# Altium project EIS_CO2_V1_1.PrjPcb
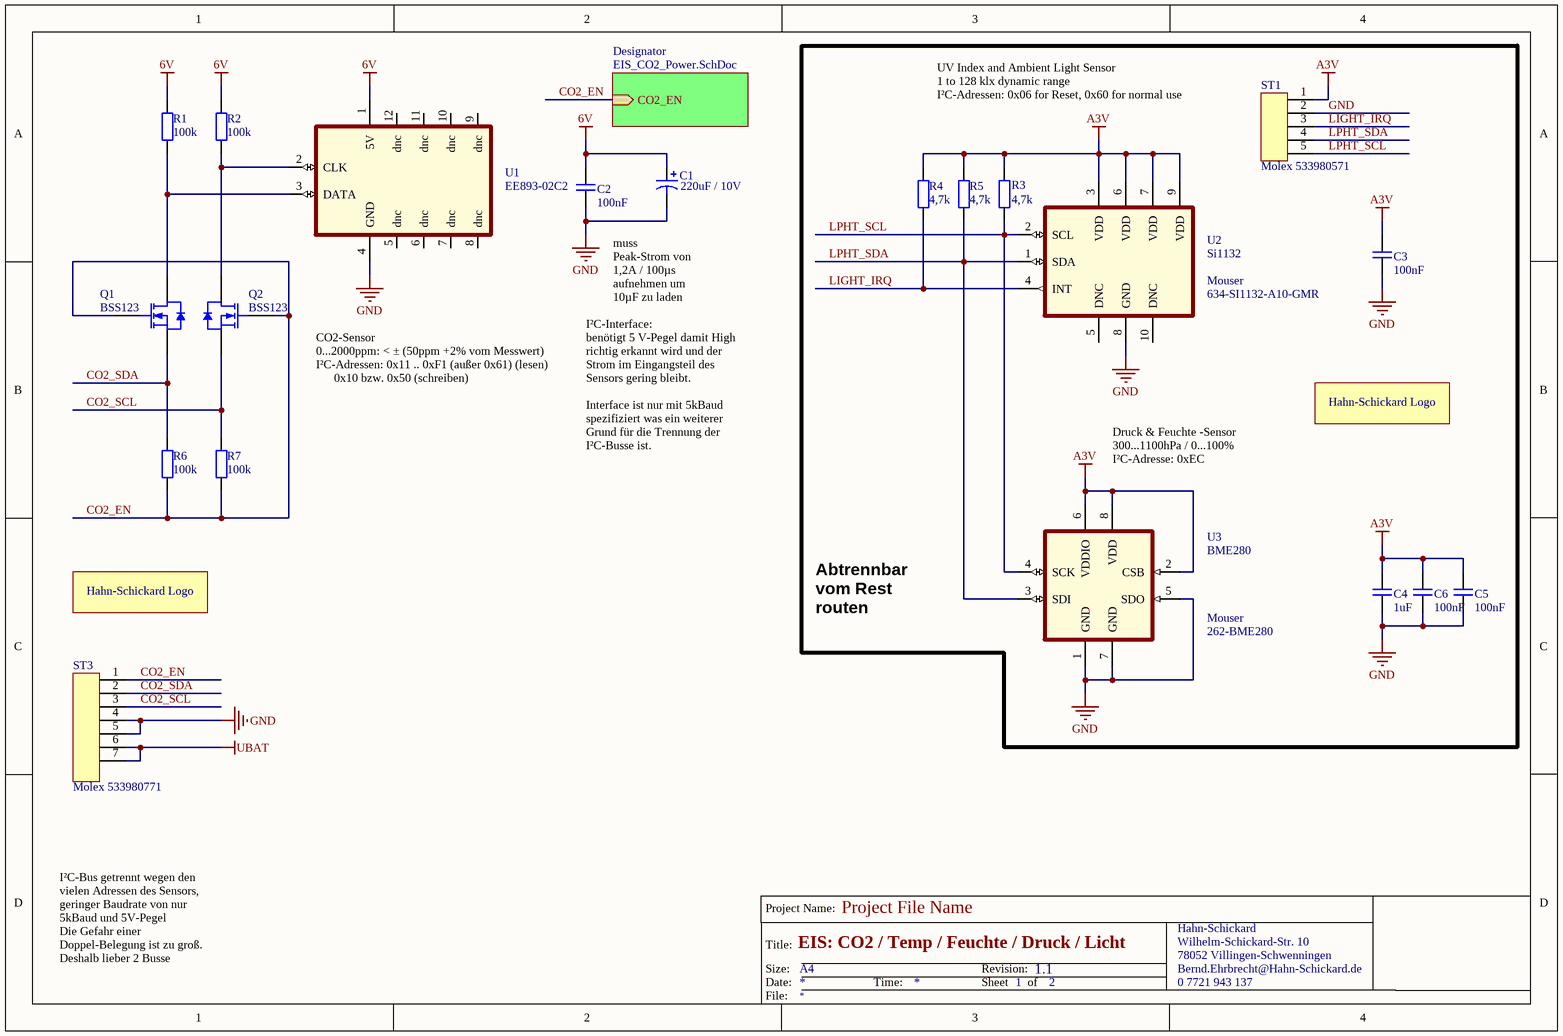
[diagram p0: EIS_Sensoren_V1_1.SchDoc]
2 sheets, 49 parts. Net scope: hierarchical (ports join the sheet entries above them; power ports are global).
Board file: EIS_Sensoren_V1_1.PcbDoc
Sheets:
  EIS_Sensoren_V1_1.SchDoc
    Designator = EIS_CO2_Power.SchDoc

## Sheet EIS_Sensoren_V1_1.SchDoc: EIS: CO2 / Temp / Feuchte / Druck / Licht
size A4; Organization: Hahn-Schickard; Address1: Wilhelm-Schickard-Str. 10; Address2: 78052 Villingen-Schwenningen; Address3: Bernd.Ehrbrecht@Hahn-Schickard.de; DocumentNumber: 1; Revision: 1.1; SheetNumber: 1; SheetTotal: 2; PhoneNumber: 0 7721 943 137; E-Mail: Bernd.Ehrbrecht@Hahn-Schickard.de; ProjectName: Project File Name

### Parts
C1  220uF / 10V  [D]
C2  100nF  [CAPC1608N]
C3  100nF  [CAPC1608N]
C4  1uF  [CAPC3216N]
C5  100nF  [CAPC1608N]
C6  100nF  [CAPC1608N]
LOGO1  Hahn-Schickard LOGO  [Hahn-Schickard-LOGO_klein]  (value not drawn)
LOGO2  Hahn-Schickard LOGO  [Hahn-Schickard-LOGO_klein]  (value not drawn)
Q1  BSS123  [SOT23_N - BSS123]
Q2  BSS123  [SOT23_N - BSS123]
R1  100k  [RESC1608N]
R2  100k  [RESC1608N]
R3  4,7k  [RESC1608N]
R4  4,7k  [RESC1608N]
R5  4,7k  [RESC1608N]
R6  100k  [RESC1608N]
R7  100k  [RESC1608N]
ST1  Molex 533980571  [Molex 533980571]
ST3  Molex 533980771  [Molex 533980771]
U1  EE893-02C2  [EE893]
U2  Si1132  Supplier 1: Mouser  Supplier Part Number 1: 634-SI1132-A10-GMR  [Si1132]
U3  BME280  Supplier 1: Mouser  Supplier Part Number 1: 262-BME280  [BME280]

### Sub-sheets
Designator = EIS_CO2_Power.SchDoc: CO2_EN (in)

### Nets
6V: C1.1 C2.1 R1.2 R2.2 U1.1(5V)
A3V: C3.1 C4.1 C5.1 C6.1 R3.2 R4.2 R5.2 ST1.1 U2.3(VDD) U2.6(VDD) U2.7(VDD) U2.9(VDD) U3.2(CSB) U3.6(VDDIO) U3.8(VDD)
GND: C1.2 C2.2 C3.2 C4.2 C5.2 C6.2 ST1.2 ST3.4 ST3.5 U1.4(GND) U2.8(GND) U3.1(GND) U3.5(SDO) U3.7(GND)
UBAT: ST3.6 ST3.7
CO2_EN: Q1.1(G) Q2.1(G) R6.1 R7.1 ST3.1 ; sheet Designator/CO2_EN
CO2_SCL: Q2.2(S) R7.2 ST3.3
CO2_SDA: Q1.2(S) R6.2 ST3.2
LIGHT_IRQ: R4.1 ST1.3 U2.4(INT)
LPHT_SCL: R3.1 ST1.5 U2.2(SCL) U3.4(SCK)
LPHT_SDA: R5.1 ST1.4 U2.1(SDA) U3.3(SDI)
NetQ1_3: Q1.3(D) R1.1 U1.3(DATA)
NetQ2_3: Q2.3(D) R2.1 U1.2(CLK)

Not connected (* = marked no-connect by the designer): ST1 6 7; ST3 8 9; U1 5(dnc) 6(dnc) 7(dnc) 8(dnc) 9(dnc) 10(dnc) 11(dnc) 12(dnc); U2 5(DNC) 10(DNC)

### Notes on the sheet
- UV Index and Ambient Light Sensor
  1 to 128 klx dynamic range
  I²C-Adressen: 0x06 for Reset, 0x60 for normal use
- muss Peak-Strom von 1,2A / 100µs
  aufnehmen um 10µF zu laden
- CO2-Sensor
  0...2000ppm: < ± (50ppm +2% vom Messwert)
  I²C-Adressen: 0x11 .. 0xF1 (außer 0x61) (lesen)
  0x10 bzw. 0x50 (schreiben)
- I²C-Interface:
  benötigt 5 V-Pegel damit High richtig erkannt wird und der Strom im Eingangsteil des Sensors gering bleibt.
  Interface ist nur mit 5kBaud spezifiziert was ein weiterer Grund für die Trennung der I²C-Busse ist.
- Druck & Feuchte -Sensor
  300...1100hPa / 0...100%
  I²C-Adresse: 0xEC
- Abtrennbar vom Rest routen
- I²C-Bus getrennt wegen den vielen Adressen des Sensors, geringer Baudrate von nur 5kBaud und 5V-Pegel
  Die Gefahr einer Doppel-Belegung ist zu groß. Deshalb lieber 2 Busse
- Project Name:
- Size:
- Date:
- Title:
- A4
- Time:
- Revision:
- Sheet
- of
- File:
- (in symbol Hahn-Schickard LOGO) Hahn-Schickard Logo

### Library data of the parts
C1 = Cap Pol3: Polarized Capacitor (Surface Mount); Published: 8-Jun-2000; LatestRevisionDate: 17-Jul-2002; LatestRevisionNote: Re-released for DXP Platform.; PackageReference: C0805; Publisher: Altium Limited; Value: 220uF / 10V
C2-C6 = Kondensator SMD Keramik
  C2 C3 C5 C6: Value: 100nF
  C4: Value: 1uF
LOGO1 LOGO2 = Hahn-Schickard LOGO: Hahn-Schickard Logo als Footprint
Q1 Q2 = BSS123: N-channel Enhancement Mode Vertical D-MOSFET; Published: 17-Sep-2003; LatestRevisionDate: 12-Dec-2006; LatestRevisionNote: IPC-7351 Footprint Added.; DatasheetVersion: Apr-1995; PackageVersion: May-1999; PackageReference: SOT23; Publisher: Altium Limited; PackageDescription: 3-Pin SOT-23 Package 0.95 mm Pitch, 2.3 mm Lead Span; ComponentLink1Description: Manufacturer Link; ComponentLink1URL: http://www.semiconductors.philips.com/; ComponentLink2Description: Datasheet; ComponentLink2URL: http://www.semiconductors.philips.com/acrobat/datasheets/BSS123_3.pdf
R1-R7 = RESC1608 (R0603): Suplier: Seller; Suplier Ordering Number: Ordering Number; Published: 14.08.2009; Publisher: HSG Jürgen Merz; ComponentLink1Description: RESC1608 (R0603) 1%
  R1 R2 R6 R7: Value: 100k
  R3-R5: Value: 4,7k
ST1 = Molex 533980571: MOLEX - 53398-0571 - STIFTLEISTE, SMT, 1.25MM, 5POL; Supplier 1: Farnell; Supplier Part Number 1: 2426364
ST3 = Molex 533980771: Molex Pico 7Pol Blade SMD gerade 533980771; Supplier 1: Farnell
U1 = EE893-02C2: CO2-Sensor; I²C-Interface,
U2 = Si1132: UV INDEX AND AMBIENT LIGHT SENSOR IC WITH I2C INTERFACE, QFN 2x2mm
U3 = BME280: Bosch, Druck & Feuchte-Sensor, I2C / SPI

## Sheet EIS_CO2_Power.SchDoc: CO2-Sensor Powersupply
size A4; Organization: Hahn-Schickard; Address1: Wilhelm-Schickard-Str. 10; Address2: 78052 Villingen-Schwenningen; Address3: Bernd.Ehrbrecht@Hahn-Schickard.de; DocumentNumber: 1; Revision: 1.1; SheetNumber: 2; SheetTotal: 2; PhoneNumber: 0 7721 943 137; E-Mail: Xxxx.Xxxx@Hahn-Schickard.de; ProjectName: Project File Name
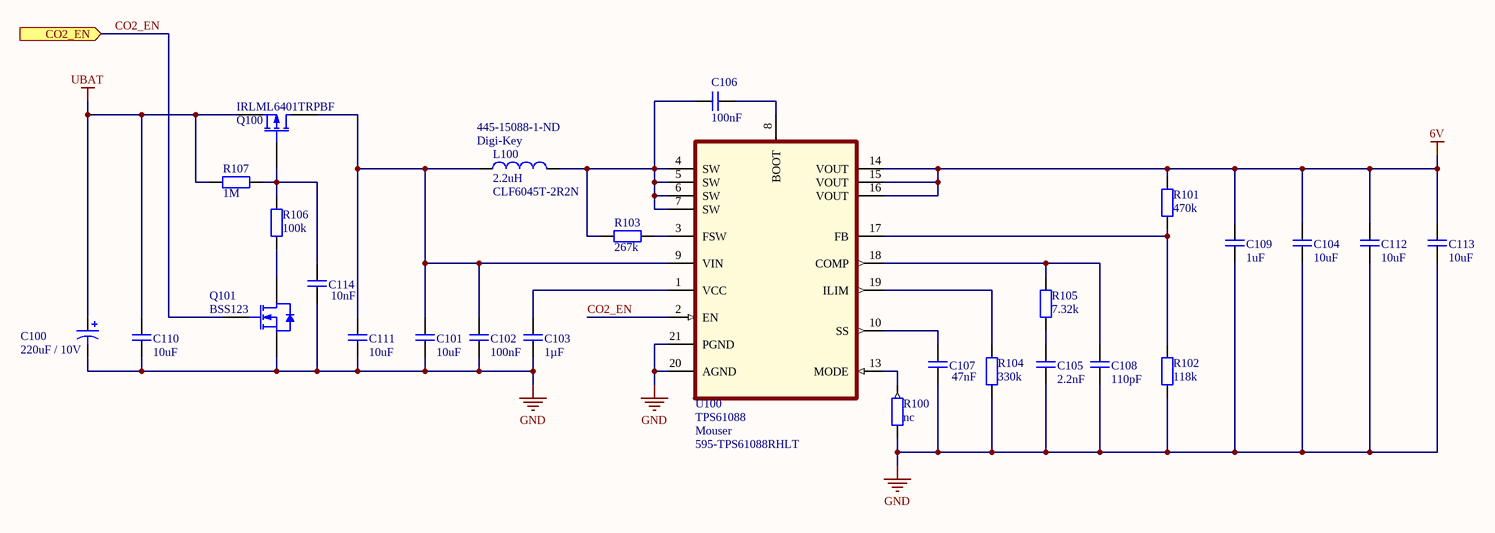
[diagram p1: EIS_CO2_Power.SchDoc]

### Parts
C100  220uF / 10V  [D]
C101  10uF  [CAPC3216N]
C102  100nF  [CAPC1608N]
C103  1µF  [CAPC1608N]
C104  10uF  [CAPC3216N]
C105  2.2nF  [CAPC1608N]
C106  100nF  [CAPC1608N]
C107  47nF  [CAPC1608N]
C108  110pF  [CAPC1608N]
C109  1uF  [CAPC3216N]
C110  10uF  [CAPC3216N]
C111  10uF  [CAPC3216N]
C112  10uF  [CAPC3216N]
C113  10uF  [CAPC3216N]
C114  10nF  [CAPC1608N]
L100  value 2.2uH  Supplier 2: Digi-Key  Supplier Part Number 2: 445-15088-1-ND  [CLF6045]  (hidden comment: CLF6045T-2R2N)
Q100  IRLML6401TRPBF  [SOT23_N]
Q101  BSS123  [SOT23_N - BSS123]
R100  nc  [RESC1608N]
R101  470k  [RESC1608N]
R102  118k  [RESC1608N]
R103  267k  [RESC1608N]
R104  330k  [RESC1608N]
R105  7.32k  [RESC1608N]
R106  100k  [RESC1608N]
R107  1M  [RESC1608N]
U100  TPS61088  Supplier 1: Mouser  Supplier Part Number 1: 595-TPS61088RHLT  [RHL0020A]

### Ports
CO2_EN (in)

### Nets
6V: C104.1 C109.1 C112.1 C113.1 R101.1 U100.14(VOUT) U100.15(VOUT) U100.16(VOUT)
GND: C100.2 C101.2 C102.1 C103.1 C104.2 C105.1 C107.1 C108.1 C109.2 C110.2 C111.2 C112.2 C113.2 C114.1 Q101.2(S) R100.2 R102.2 R104.2 U100.20(AGND) U100.21(PGND)
UBAT: C100.1 C110.1 Q100.2(S) R107.1
CO2_EN: Q101.1(G) U100.2(EN) ; port CO2_EN
NetC101_1: C101.1 C102.2 C111.1 L100.1 Q100.3(D) U100.9(VIN)
NetC103_2: C103.2 U100.1(VCC)
NetC105_2: C105.2 R105.2
NetC106_1: C106.1 L100.2 R103.2 U100.4(SW) U100.5(SW) U100.6(SW) U100.7(SW)
NetC106_2: C106.2 U100.8(BOOT)
NetC107_2: C107.2 U100.10(SS)
NetC108_2: C108.2 R105.1 U100.18(COMP)
NetC114_2: C114.2 Q100.1(G) R106.2 R107.2
NetQ101_3: Q101.3(D) R106.1
NetR100_1: R100.1 U100.13(MODE)
NetR101_2: R101.2 R102.1 U100.17(FB)
NetR103_1: R103.1 U100.3(FSW)
NetR104_1: R104.1 U100.19(ILIM)

### Notes on the sheet
- Project Name:
- Size:
- Date:
- Title:
- A4
- Time:
- Revision:
- Sheet
- of
- File:

### Library data of the parts
C100 = Cap Pol3: Polarized Capacitor (Surface Mount); Published: 8-Jun-2000; LatestRevisionDate: 17-Jul-2002; LatestRevisionNote: Re-released for DXP Platform.; PackageReference: C0805; Publisher: Altium Limited; Value: 220uF / 10V
C101-C114 = Kondensator SMD Keramik
  C101 C104 C110-C113: Value: 10uF
  C102 C106: Value: 100nF
  C103: Value: 1µF
  C105: Value: 2.2nF
  C107: Value: 47nF
  C108: Value: 110pF
  C109: Value: 1uF
  C114: Value: 10nF
L100 = Inductor: Code_IEC: 1005; Published: 8-Jun-2000; LatestRevisionDate: 29-May-2009; LatestRevisionNote: IPC-7351 Footprint Added.; PackageReference: 0402-A; Publisher: Altium Limited; PackageDescription: Chip Inductor; Code_JEITA: 0402; Supplier 1: Digi-Key; Supplier Part Number 1: CLF6045T-2R2N
Q100 = IRLML6401TRPBF: P-Channel MOSFET; Published: 8-Jun-2000; LatestRevisionDate: 17-Jul-2002; LatestRevisionNote: Re-released for DXP Platform.; PackageVersion: 1995/1996; PackageReference: E3; Publisher: Altium Limited
Q101 = BSS123: as Q1 on sheet EIS_Sensoren_V1_1; Published: 17-Sep-2003; LatestRevisionDate: 12-Dec-2006; LatestRevisionNote: IPC-7351 Footprint Added.; DatasheetVersion: Apr-1995; PackageVersion: May-1999; PackageReference: SOT23; Publisher: Altium Limited; PackageDescription: 3-Pin SOT-23 Package 0.95 mm Pitch, 2.3 mm Lead Span; ComponentLink1Description: Manufacturer Link; ComponentLink1URL: http://www.semiconductors.philips.com/; ComponentLink2Description: Datasheet; ComponentLink2URL: http://www.semiconductors.philips.com/acrobat/datasheets/BSS123_3.pdf
R100-R107 = RESC1608 (R0603): as R1 on sheet EIS_Sensoren_V1_1; Published: 14.08.2009; Publisher: HSG Jürgen Merz; ComponentLink1Description: RESC1608 (R0603) 1%
  R100: Value: nc
  R101: Value: 470k
  R102: Value: 118k
  R103: Value: 267k
  R104: Value: 330k
  R105: Value: 7.32k
  R106: Value: 100k
  R107: Value: 1M
U100 = TPS61088: Boost Schaltregler, 2,7V - 12 Uin / 4.5V-12.6V Uout / 3A / 1µA Shutdown

## Nets that join several sheets
6V: EIS_Sensoren_V1_1 (5 pins), EIS_CO2_Power (8 pins)
GND: EIS_Sensoren_V1_1 (14 pins), EIS_CO2_Power (20 pins)
UBAT: EIS_Sensoren_V1_1 (ST3.6 ST3.7), EIS_CO2_Power (C100.1 C110.1 Q100.2 R107.1)
CO2_EN: EIS_Sensoren_V1_1 (5 pins), EIS_CO2_Power (Q101.1 U100.2)